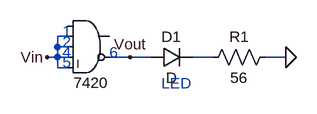
[diagram p0: schematic led_driver.asc]
led_driver.asc, the LTspice schematic file:
Version 4
SHEET 1 880 680
WIRE 176 144 160 144
WIRE 160 160 160 144
WIRE 176 160 160 160
WIRE 160 176 160 160
WIRE 160 176 144 176
WIRE 176 176 160 176
WIRE 272 176 240 176
WIRE 304 176 272 176
WIRE 400 176 368 176
WIRE 512 176 480 176
WIRE 160 192 160 176
WIRE 176 192 160 192
FLAG 512 176 0
FLAG 144 176 Vin
FLAG 272 176 Vout
SYMBOL diode 304 192 R270
WINDOW 0 32 32 VTop 2
WINDOW 3 0 32 VBottom 2
SYMATTR InstName D1
SYMBOL res 384 192 R270
WINDOW 0 32 56 VTop 2
WINDOW 3 0 56 VBottom 2
SYMATTR InstName R1
SYMATTR Value 56
SYMBOL Digital\\and 208 96 R0
WINDOW 0 -23 119 Left 2
SYMATTR InstName 7420
TEXT 320 216 Left 2 ;LED
TEXT 168 136 Left 2 ;1
TEXT 168 152 Left 2 ;2
TEXT 168 168 Left 2 ;4
TEXT 168 184 Left 2 ;5
TEXT 240 168 Left 2 ;6

The netlist it stands for:
* led_driver.asc
D1 Vout N001 D
R1 N001 0 56
A§7420 0 Vin Vin Vin Vin Vout 0 0 AND
.model D D
.lib standard.dio
* LED
* 1
* 2
* 4
* 5
* 6
.backanno
.end